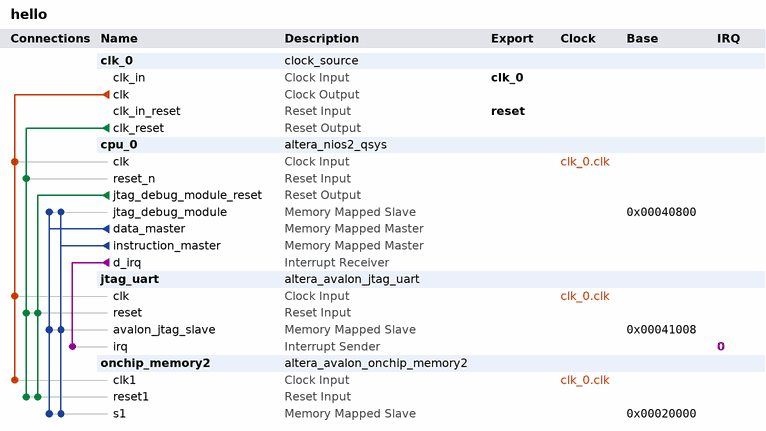
[diagram p0: system contents]
# Platform Designer (Qsys) system hello, Cyclone IV E EP4CE40F23C8
# Parameters at their usual value, and those the tool derives, are not listed.
package require -exact qsys 15.0
create_system hello
set_project_property DEVICE_FAMILY {Cyclone IV E}
set_project_property DEVICE EP4CE40F23C8

add_instance clk_0 clock_source 15.0
set_instance_parameter_value clk_0 clockFrequency 50000000

add_instance cpu_0 altera_nios2_qsys 15.0
set_instance_parameter_value cpu_0 breakSlave cpu_0.jtag_debug_module
set_instance_parameter_value cpu_0 exceptionSlave onchip_memory2.s1
set_instance_parameter_value cpu_0 icache_size 4096
set_instance_parameter_value cpu_0 impl Tiny
set_instance_parameter_value cpu_0 mmu_TLBMissExcSlave None
set_instance_parameter_value cpu_0 resetSlave onchip_memory2.s1
set_instance_parameter_value cpu_0 resetrequest_enabled true

add_instance jtag_uart altera_avalon_jtag_uart 15.0
set_instance_parameter_value jtag_uart simInteractiveOptions NO_INTERACTIVE_WINDOWS

add_instance onchip_memory2 altera_avalon_onchip_memory2 15.0
set_instance_parameter_value onchip_memory2 dataWidth 32
set_instance_parameter_value onchip_memory2 dualPort false
set_instance_parameter_value onchip_memory2 initMemContent true
set_instance_parameter_value onchip_memory2 initializationFileName onchip_mem.hex
set_instance_parameter_value onchip_memory2 memorySize 102400

# connections
add_connection clk_0.clk cpu_0.clk clock
add_connection clk_0.clk jtag_uart.clk clock
add_connection clk_0.clk onchip_memory2.clk1 clock
add_connection clk_0.clk_reset cpu_0.reset_n reset
add_connection clk_0.clk_reset jtag_uart.reset reset
add_connection clk_0.clk_reset onchip_memory2.reset1 reset
add_connection cpu_0.jtag_debug_module_reset jtag_uart.reset reset
add_connection cpu_0.jtag_debug_module_reset onchip_memory2.reset1 reset
add_connection cpu_0.data_master cpu_0.jtag_debug_module avalon
set_connection_parameter_value cpu_0.data_master/cpu_0.jtag_debug_module baseAddress 0x00040800
add_connection cpu_0.data_master jtag_uart.avalon_jtag_slave avalon
set_connection_parameter_value cpu_0.data_master/jtag_uart.avalon_jtag_slave baseAddress 0x00041008
add_connection cpu_0.data_master onchip_memory2.s1 avalon
set_connection_parameter_value cpu_0.data_master/onchip_memory2.s1 baseAddress 0x00020000
add_connection cpu_0.instruction_master cpu_0.jtag_debug_module avalon
set_connection_parameter_value cpu_0.instruction_master/cpu_0.jtag_debug_module baseAddress 0x00040800
add_connection cpu_0.instruction_master jtag_uart.avalon_jtag_slave avalon
set_connection_parameter_value cpu_0.instruction_master/jtag_uart.avalon_jtag_slave baseAddress 0x00041008
add_connection cpu_0.instruction_master onchip_memory2.s1 avalon
set_connection_parameter_value cpu_0.instruction_master/onchip_memory2.s1 baseAddress 0x00020000
add_connection cpu_0.d_irq jtag_uart.irq interrupt
set_connection_parameter_value cpu_0.d_irq/jtag_uart.irq irqNumber 0

# exported interfaces
add_interface clk_0 clock sink
set_interface_property clk_0 EXPORT_OF clk_0.clk_in
add_interface reset reset sink
set_interface_property reset EXPORT_OF clk_0.clk_in_reset

set_interconnect_requirement {$system} qsys_mm.clockCrossingAdapter HANDSHAKE
set_interconnect_requirement {$system} qsys_mm.enableEccProtection FALSE
set_interconnect_requirement {$system} qsys_mm.insertDefaultSlave FALSE
set_interconnect_requirement {$system} qsys_mm.maxAdditionalLatency 1

save_system hello.qsys
